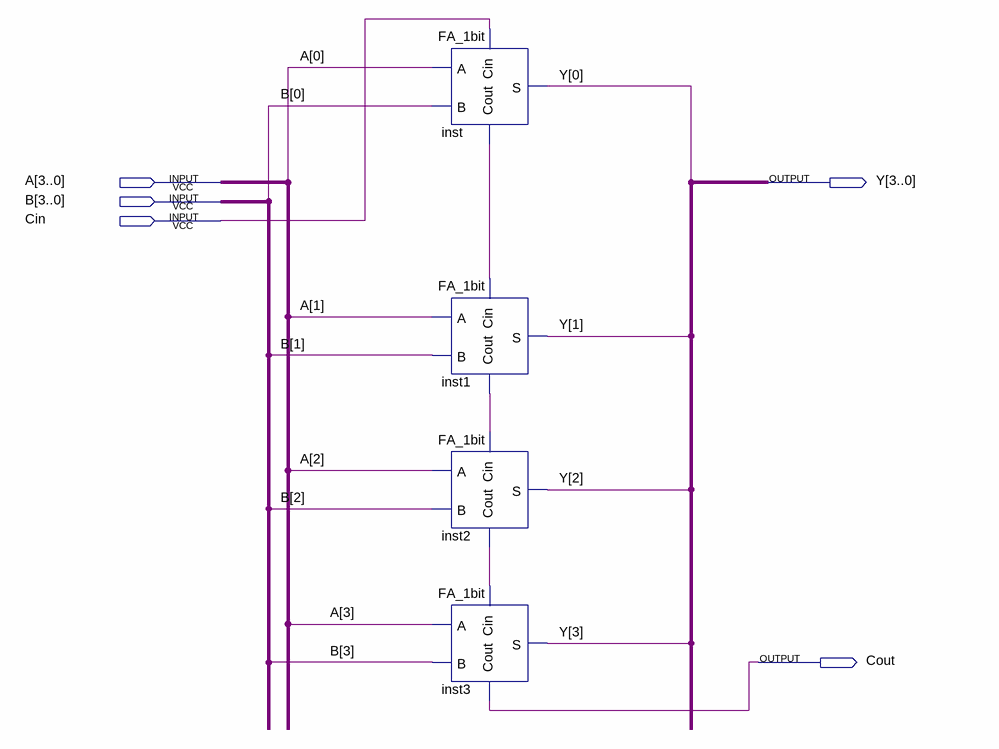
[diagram p0: schematic sheet]
// Quartus schematic FA_4bits.bdf as structural Verilog: 4 symbols, 5 pins
module FA_4bits (
  input  [3:0] A,
  input  [3:0] B,
  input  Cin,
  output [3:0] Y,
  output Cout
);

  wire inst1_cout, inst2_cout, inst_cout;

  FA_1bit inst (.A(A[0]), .B(B[0]), .Cin(Cin), .S(Y[0]), .Cout(inst_cout));
  FA_1bit inst1 (.A(A[1]), .B(B[1]), .Cin(inst_cout), .S(Y[1]), .Cout(inst1_cout));
  FA_1bit inst2 (.A(A[2]), .B(B[2]), .Cin(inst1_cout), .S(Y[2]), .Cout(inst2_cout));
  FA_1bit inst3 (.A(A[3]), .B(B[3]), .Cin(inst2_cout), .S(Y[3]), .Cout(Cout));
endmodule
